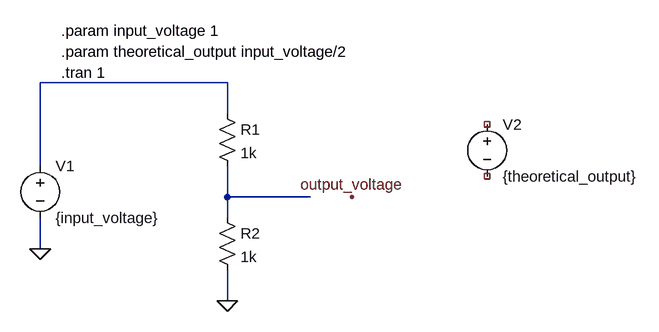
[diagram p0: schematic EP3_divider.asc]
EP3_divider.asc, the LTspice schematic file:
Version 4.1
SHEET 1 992 680
WIRE 320 -96 32 -96
WIRE 320 -48 320 -96
WIRE 32 32 32 -96
WIRE 320 80 320 32
WIRE 448 80 320 80
WIRE 320 112 320 80
WIRE 32 160 32 112
WIRE 320 240 320 192
FLAG 32 160 0
FLAG 320 240 0
FLAG 512 80 output_voltage
SYMBOL voltage 32 16 R0
SYMATTR InstName V1
SYMATTR Value {input_voltage}
SYMBOL res 304 -64 R0
SYMATTR InstName R1
SYMATTR Value 1k
SYMBOL res 304 96 R0
SYMATTR InstName R2
SYMATTR Value 1k
SYMBOL voltage 720 -48 R0
SYMATTR InstName V2
SYMATTR Value {theoretical_output}
TEXT 64 -176 Left 2 !.param input_voltage 1
TEXT 64 -144 Left 2 !.param theoretical_output input_voltage/2
TEXT 64 -112 Left 2 !.tran 1

The netlist it stands for:
* EP3_divider.asc
V1 N001 0 {input_voltage}
R1 N001 N002 1k
R2 N002 0 1k
V2 NC_01 NC_02 {theoretical_output}
.param input_voltage 1
.param theoretical_output input_voltage/2
.tran 1
.backanno
.end